# Altium schematic sheet IOStandardsTests.SchDoc
size A2
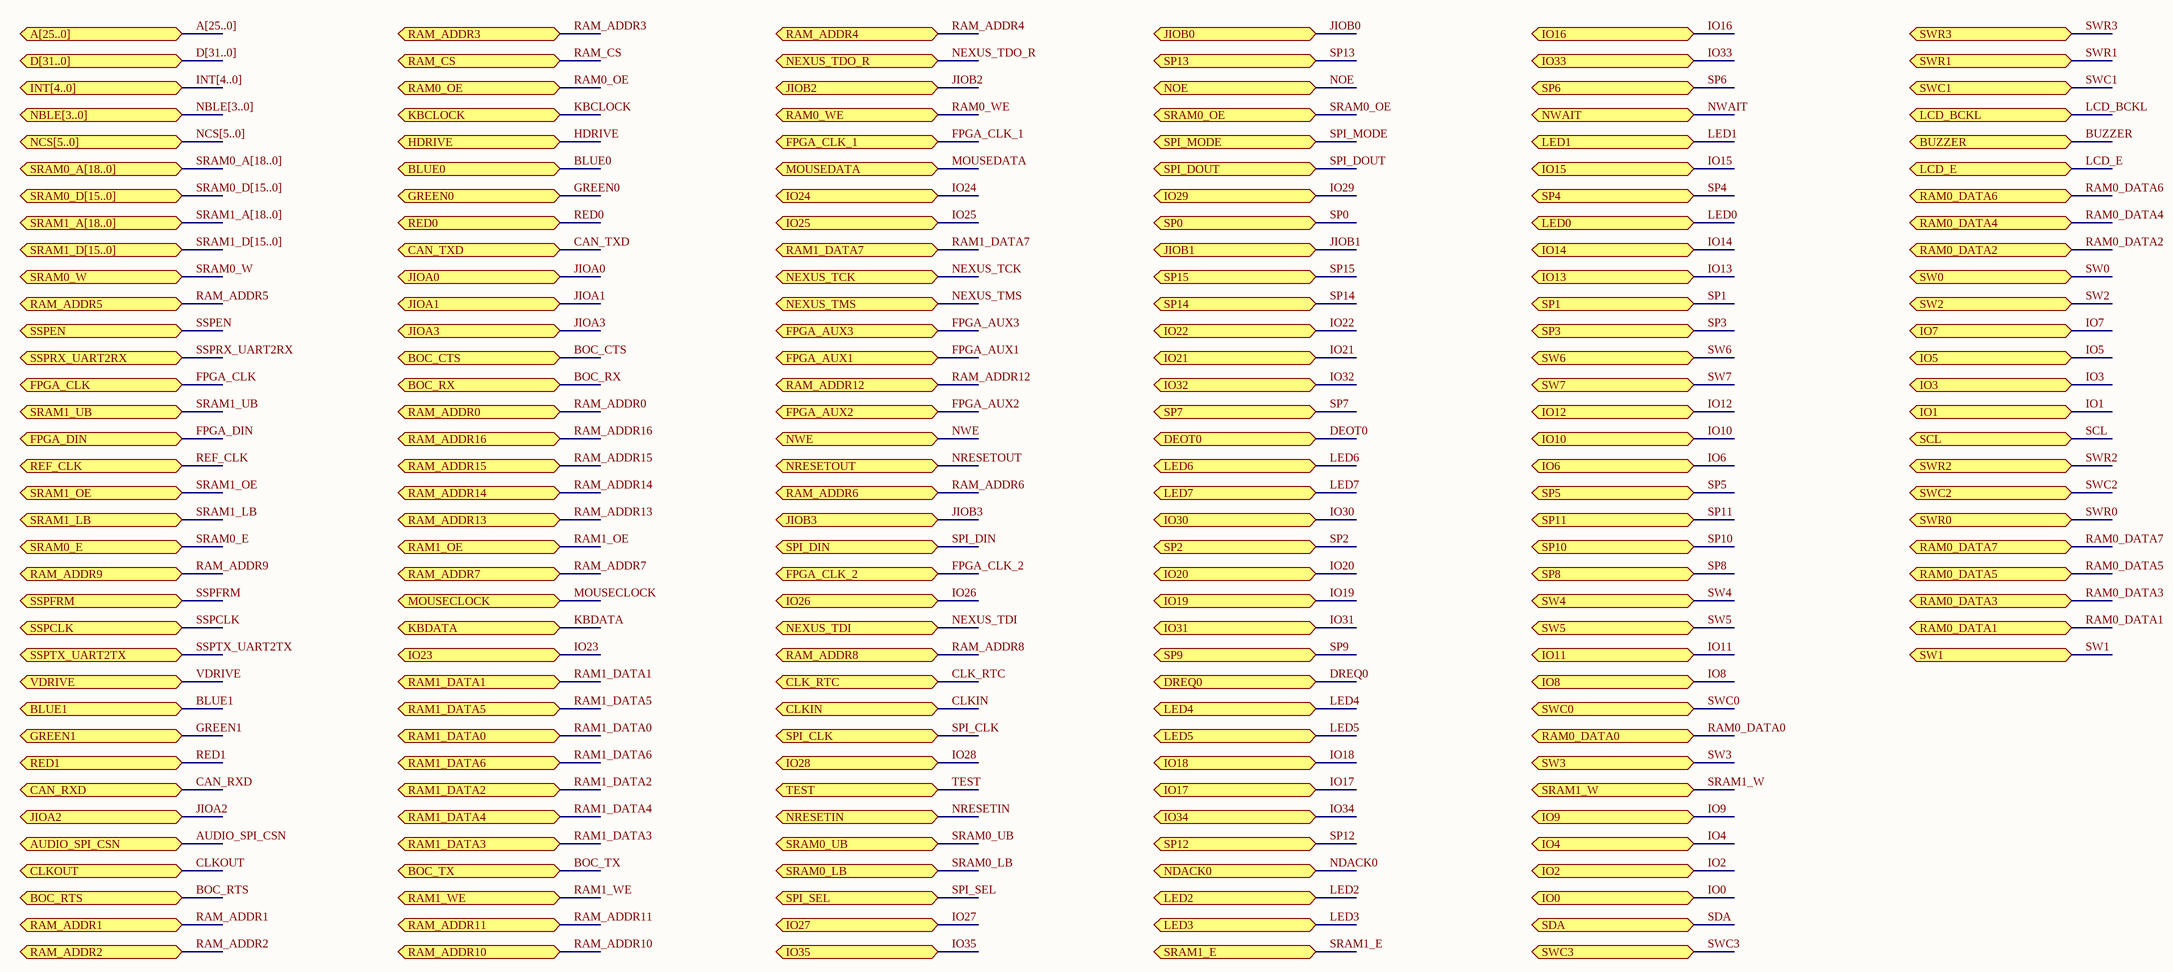
[diagram p0: IOStandardsTests.SchDoc]

## Ports
A[25..0] (bidir), AUDIO_SPI_CSN (bidir), BLUE0 (bidir), BLUE1 (bidir), BOC_CTS (bidir), BOC_RTS (bidir), BOC_RX (bidir), BOC_TX (bidir), BUZZER (bidir), CAN_RXD (bidir), CAN_TXD (bidir), CLK_RTC (bidir), CLKIN (bidir), CLKOUT (bidir), D[31..0] (bidir), DEOT0 (bidir), DREQ0 (bidir), FPGA_AUX1 (bidir), FPGA_AUX2 (bidir), FPGA_AUX3 (bidir), FPGA_CLK (bidir), FPGA_CLK_1 (bidir), FPGA_CLK_2 (bidir), FPGA_DIN (bidir), GREEN0 (bidir), GREEN1 (bidir), HDRIVE (bidir), INT[4..0] (bidir), IO0 (bidir), IO1 (bidir), IO2 (bidir), IO3 (bidir), IO4 (bidir), IO5 (bidir), IO6 (bidir), IO7 (bidir), IO8 (bidir), IO9 (bidir), IO10 (bidir), IO11 (bidir), IO12 (bidir), IO13 (bidir), IO14 (bidir), IO15 (bidir), IO16 (bidir), IO17 (bidir), IO18 (bidir), IO19 (bidir), IO20 (bidir), IO21 (bidir), IO22 (bidir), IO23 (bidir), IO24 (bidir), IO25 (bidir), IO26 (bidir), IO27 (bidir), IO28 (bidir), IO29 (bidir), IO30 (bidir), IO31 (bidir), IO32 (bidir), IO33 (bidir), IO34 (bidir), IO35 (bidir), JIOA0 (bidir), JIOA1 (bidir), JIOA2 (bidir), JIOA3 (bidir), JIOB0 (bidir), JIOB1 (bidir), JIOB2 (bidir), JIOB3 (bidir), KBCLOCK (bidir), KBDATA (bidir), LCD_BCKL (bidir), LCD_E (bidir), LED0 (bidir), LED1 (bidir), LED2 (bidir), LED3 (bidir), LED4 (bidir), LED5 (bidir), LED6 (bidir), LED7 (bidir), MOUSECLOCK (bidir), MOUSEDATA (bidir), NBLE[3..0] (bidir), NCS[5..0] (bidir), NDACK0 (bidir), NEXUS_TCK (bidir), NEXUS_TDI (bidir), NEXUS_TDO_R (bidir), NEXUS_TMS (bidir), NOE (bidir), NRESETIN (bidir), NRESETOUT (bidir), NWAIT (bidir), NWE (bidir), RAM0_DATA0 (bidir), RAM0_DATA1 (bidir), RAM0_DATA2 (bidir), RAM0_DATA3 (bidir), RAM0_DATA4 (bidir), RAM0_DATA5 (bidir), RAM0_DATA6 (bidir), RAM0_DATA7 (bidir), RAM0_OE (bidir), RAM0_WE (bidir), RAM1_DATA0 (bidir), RAM1_DATA1 (bidir), RAM1_DATA2 (bidir), RAM1_DATA3 (bidir), RAM1_DATA4 (bidir), RAM1_DATA5 (bidir), RAM1_DATA6 (bidir), RAM1_DATA7 (bidir), RAM1_OE (bidir), RAM1_WE (bidir), RAM_ADDR0 (bidir), RAM_ADDR1 (bidir), RAM_ADDR2 (bidir), RAM_ADDR3 (bidir), RAM_ADDR4 (bidir), RAM_ADDR5 (bidir), RAM_ADDR6 (bidir), RAM_ADDR7 (bidir), RAM_ADDR8 (bidir), RAM_ADDR9 (bidir), RAM_ADDR10 (bidir), RAM_ADDR11 (bidir), RAM_ADDR12 (bidir), RAM_ADDR13 (bidir), RAM_ADDR14 (bidir), RAM_ADDR15 (bidir), RAM_ADDR16 (bidir), RAM_CS (bidir), RED0 (bidir), RED1 (bidir), REF_CLK (bidir), SCL (bidir), SDA (bidir), SP0 (bidir), SP1 (bidir), SP2 (bidir), SP3 (bidir), SP4 (bidir), SP5 (bidir), SP6 (bidir), SP7 (bidir), SP8 (bidir), SP9 (bidir), SP10 (bidir), SP11 (bidir), SP12 (bidir), SP13 (bidir), SP14 (bidir), SP15 (bidir), SPI_CLK (bidir), SPI_DIN (bidir), SPI_DOUT (bidir), SPI_MODE (bidir), SPI_SEL (bidir), SRAM0_A[18..0] (bidir), SRAM0_D[15..0] (bidir), SRAM0_E (bidir), SRAM0_LB (bidir), SRAM0_OE (bidir), SRAM0_UB (bidir), SRAM0_W (bidir), SRAM1_A[18..0] (bidir), SRAM1_D[15..0] (bidir), SRAM1_E (bidir), SRAM1_LB (bidir), SRAM1_OE (bidir), SRAM1_UB (bidir), SRAM1_W (bidir), SSPCLK (bidir), SSPEN (bidir), SSPFRM (bidir), SSPRX_UART2RX (bidir), SSPTX_UART2TX (bidir), SW0 (bidir), SW1 (bidir), SW2 (bidir), SW3 (bidir), SW4 (bidir), SW5 (bidir), SW6 (bidir), SW7 (bidir), SWC0 (bidir), SWC1 (bidir), SWC2 (bidir), SWC3 (bidir), SWR0 (bidir), SWR1 (bidir), SWR2 (bidir), SWR3 (bidir), TEST (bidir), VDRIVE (bidir)

## Nets
AUDIO_SPI_CSN: port AUDIO_SPI_CSN
BLUE0: port BLUE0
BLUE1: port BLUE1
BOC_CTS: port BOC_CTS
BOC_RTS: port BOC_RTS
BOC_RX: port BOC_RX
BOC_TX: port BOC_TX
BUZZER: port BUZZER
CAN_RXD: port CAN_RXD
CAN_TXD: port CAN_TXD
CLK_RTC: port CLK_RTC
CLKIN: port CLKIN
CLKOUT: port CLKOUT
DEOT0: port DEOT0
DREQ0: port DREQ0
FPGA_AUX1: port FPGA_AUX1
FPGA_AUX2: port FPGA_AUX2
FPGA_AUX3: port FPGA_AUX3
FPGA_CLK: port FPGA_CLK
FPGA_CLK_1: port FPGA_CLK_1
FPGA_CLK_2: port FPGA_CLK_2
FPGA_DIN: port FPGA_DIN
GREEN0: port GREEN0
GREEN1: port GREEN1
HDRIVE: port HDRIVE
IO0: port IO0
IO1: port IO1
IO2: port IO2
IO3: port IO3
IO4: port IO4
IO5: port IO5
IO6: port IO6
IO7: port IO7
IO8: port IO8
IO9: port IO9
IO10: port IO10
IO11: port IO11
IO12: port IO12
IO13: port IO13
IO14: port IO14
IO15: port IO15
IO16: port IO16
IO17: port IO17
IO18: port IO18
IO19: port IO19
IO20: port IO20
IO21: port IO21
IO22: port IO22
IO23: port IO23
IO24: port IO24
IO25: port IO25
IO26: port IO26
IO27: port IO27
IO28: port IO28
IO29: port IO29
IO30: port IO30
IO31: port IO31
IO32: port IO32
IO33: port IO33
IO34: port IO34
IO35: port IO35
JIOA0: port JIOA0
JIOA1: port JIOA1
JIOA2: port JIOA2
JIOA3: port JIOA3
JIOB0: port JIOB0
JIOB1: port JIOB1
JIOB2: port JIOB2
JIOB3: port JIOB3
KBCLOCK: port KBCLOCK
KBDATA: port KBDATA
LCD_BCKL: port LCD_BCKL
LCD_E: port LCD_E
LED0: port LED0
LED1: port LED1
LED2: port LED2
LED3: port LED3
LED4: port LED4
LED5: port LED5
LED6: port LED6
LED7: port LED7
MOUSECLOCK: port MOUSECLOCK
MOUSEDATA: port MOUSEDATA
NDACK0: port NDACK0
NEXUS_TCK: port NEXUS_TCK
NEXUS_TDI: port NEXUS_TDI
NEXUS_TDO_R: port NEXUS_TDO_R
NEXUS_TMS: port NEXUS_TMS
NOE: port NOE
NRESETIN: port NRESETIN
NRESETOUT: port NRESETOUT
NWAIT: port NWAIT
NWE: port NWE
RAM0_DATA0: port RAM0_DATA0
RAM0_DATA1: port RAM0_DATA1
RAM0_DATA2: port RAM0_DATA2
RAM0_DATA3: port RAM0_DATA3
RAM0_DATA4: port RAM0_DATA4
RAM0_DATA5: port RAM0_DATA5
RAM0_DATA6: port RAM0_DATA6
RAM0_DATA7: port RAM0_DATA7
RAM0_OE: port RAM0_OE
RAM0_WE: port RAM0_WE
RAM1_DATA0: port RAM1_DATA0
RAM1_DATA1: port RAM1_DATA1
RAM1_DATA2: port RAM1_DATA2
RAM1_DATA3: port RAM1_DATA3
RAM1_DATA4: port RAM1_DATA4
RAM1_DATA5: port RAM1_DATA5
RAM1_DATA6: port RAM1_DATA6
RAM1_DATA7: port RAM1_DATA7
RAM1_OE: port RAM1_OE
RAM1_WE: port RAM1_WE
RAM_ADDR0: port RAM_ADDR0
RAM_ADDR1: port RAM_ADDR1
RAM_ADDR2: port RAM_ADDR2
RAM_ADDR3: port RAM_ADDR3
RAM_ADDR4: port RAM_ADDR4
RAM_ADDR5: port RAM_ADDR5
RAM_ADDR6: port RAM_ADDR6
RAM_ADDR7: port RAM_ADDR7
RAM_ADDR8: port RAM_ADDR8
RAM_ADDR9: port RAM_ADDR9
RAM_ADDR10: port RAM_ADDR10
RAM_ADDR11: port RAM_ADDR11
RAM_ADDR12: port RAM_ADDR12
RAM_ADDR13: port RAM_ADDR13
RAM_ADDR14: port RAM_ADDR14
RAM_ADDR15: port RAM_ADDR15
RAM_ADDR16: port RAM_ADDR16
RAM_CS: port RAM_CS
RED0: port RED0
RED1: port RED1
REF_CLK: port REF_CLK
SCL: port SCL
SDA: port SDA
SP0: port SP0
SP1: port SP1
SP2: port SP2
SP3: port SP3
SP4: port SP4
SP5: port SP5
SP6: port SP6
SP7: port SP7
SP8: port SP8
SP9: port SP9
SP10: port SP10
SP11: port SP11
SP12: port SP12
SP13: port SP13
SP14: port SP14
SP15: port SP15
SPI_CLK: port SPI_CLK
SPI_DIN: port SPI_DIN
SPI_DOUT: port SPI_DOUT
SPI_MODE: port SPI_MODE
SPI_SEL: port SPI_SEL
SRAM0_E: port SRAM0_E
SRAM0_LB: port SRAM0_LB
SRAM0_OE: port SRAM0_OE
SRAM0_UB: port SRAM0_UB
SRAM0_W: port SRAM0_W
SRAM1_E: port SRAM1_E
SRAM1_LB: port SRAM1_LB
SRAM1_OE: port SRAM1_OE
SRAM1_UB: port SRAM1_UB
SRAM1_W: port SRAM1_W
SSPCLK: port SSPCLK
SSPEN: port SSPEN
SSPFRM: port SSPFRM
SSPRX_UART2RX: port SSPRX_UART2RX
SSPTX_UART2TX: port SSPTX_UART2TX
SW0: port SW0
SW1: port SW1
SW2: port SW2
SW3: port SW3
SW4: port SW4
SW5: port SW5
SW6: port SW6
SW7: port SW7
SWC0: port SWC0
SWC1: port SWC1
SWC2: port SWC2
SWC3: port SWC3
SWR0: port SWR0
SWR1: port SWR1
SWR2: port SWR2
SWR3: port SWR3
TEST: port TEST
VDRIVE: port VDRIVE

## Buses and harness runs
bus A[25..0] = port A[25..0]
bus D[31..0] = port D[31..0]
bus INT[4..0] = port INT[4..0]
bus NBLE[3..0] = port NBLE[3..0]
bus NCS[5..0] = port NCS[5..0]
bus SRAM0_A[18..0] = port SRAM0_A[18..0]
bus SRAM0_D[15..0] = port SRAM0_D[15..0]
bus SRAM1_A[18..0] = port SRAM1_A[18..0]
bus SRAM1_D[15..0] = port SRAM1_D[15..0]